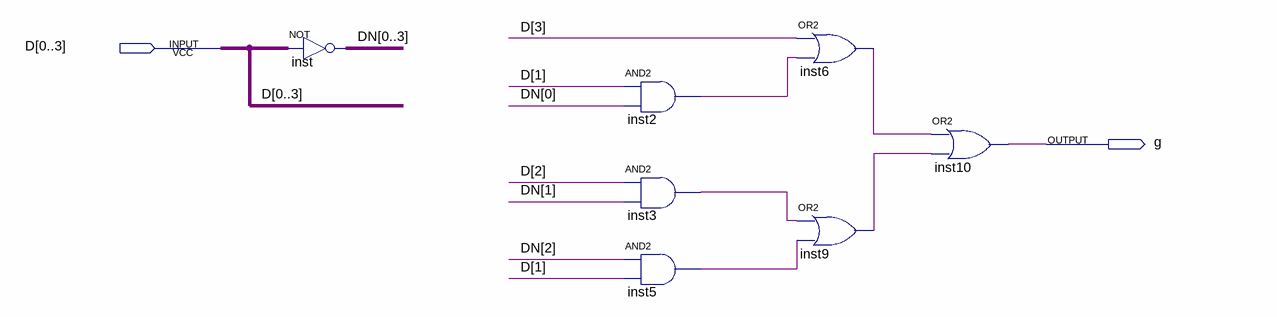
[diagram p0: schematic sheet]
// Quartus schematic d6.bdf as structural Verilog: 7 symbols, 2 pins
module d6 (
  input  [0:3] D,
  output g
);

  wire inst2_out, inst3_out, inst5_out, inst6_out, inst9_out;
  wire [3:0] DN;

  assign {DN[0], DN[1], DN[2], DN[3]} = ~D;  // NOT inst, 4 bits wide
  and inst2 (inst2_out, D[1], DN[0]);
  and inst3 (inst3_out, D[2], DN[1]);
  and inst5 (inst5_out, DN[2], D[1]);
  or inst6 (inst6_out, D[3], inst2_out);
  or inst9 (inst9_out, inst3_out, inst5_out);
  or inst10 (g, inst6_out, inst9_out);
endmodule
